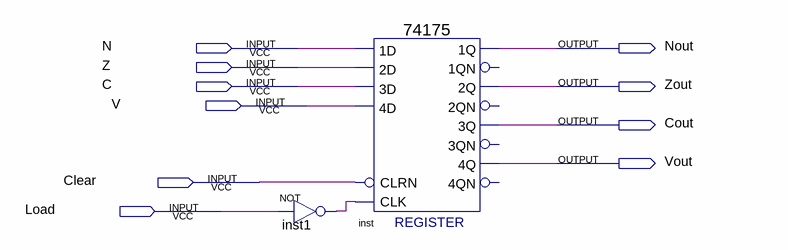
[diagram p0: schematic sheet]
// Quartus schematic pi_po_register_74175.bdf as structural Verilog: 2 symbols, 10 pins
module pi_po_register_74175 (
  input  N,
  input  Z,
  input  C,
  input  V,
  input  Clear,
  input  Load,
  output Nout,
  output Zout,
  output Cout,
  output Vout
);

  wire inst1_out;

  not inst1 (inst1_out, Load);
  \74175  inst (
    .CLRN(Clear), .CLK(inst1_out), .\3D (C), .\2D (Z), .\1D (N), .\4D (V), .\1Q (Nout), .\3Q (Cout),
    .\2Q (Zout), .\4Q (Vout));  // open: 1QN, 2QN, 4QN, 3QN
endmodule
